# Altium schematic sheet Schematic_1.SchDoc
size A3
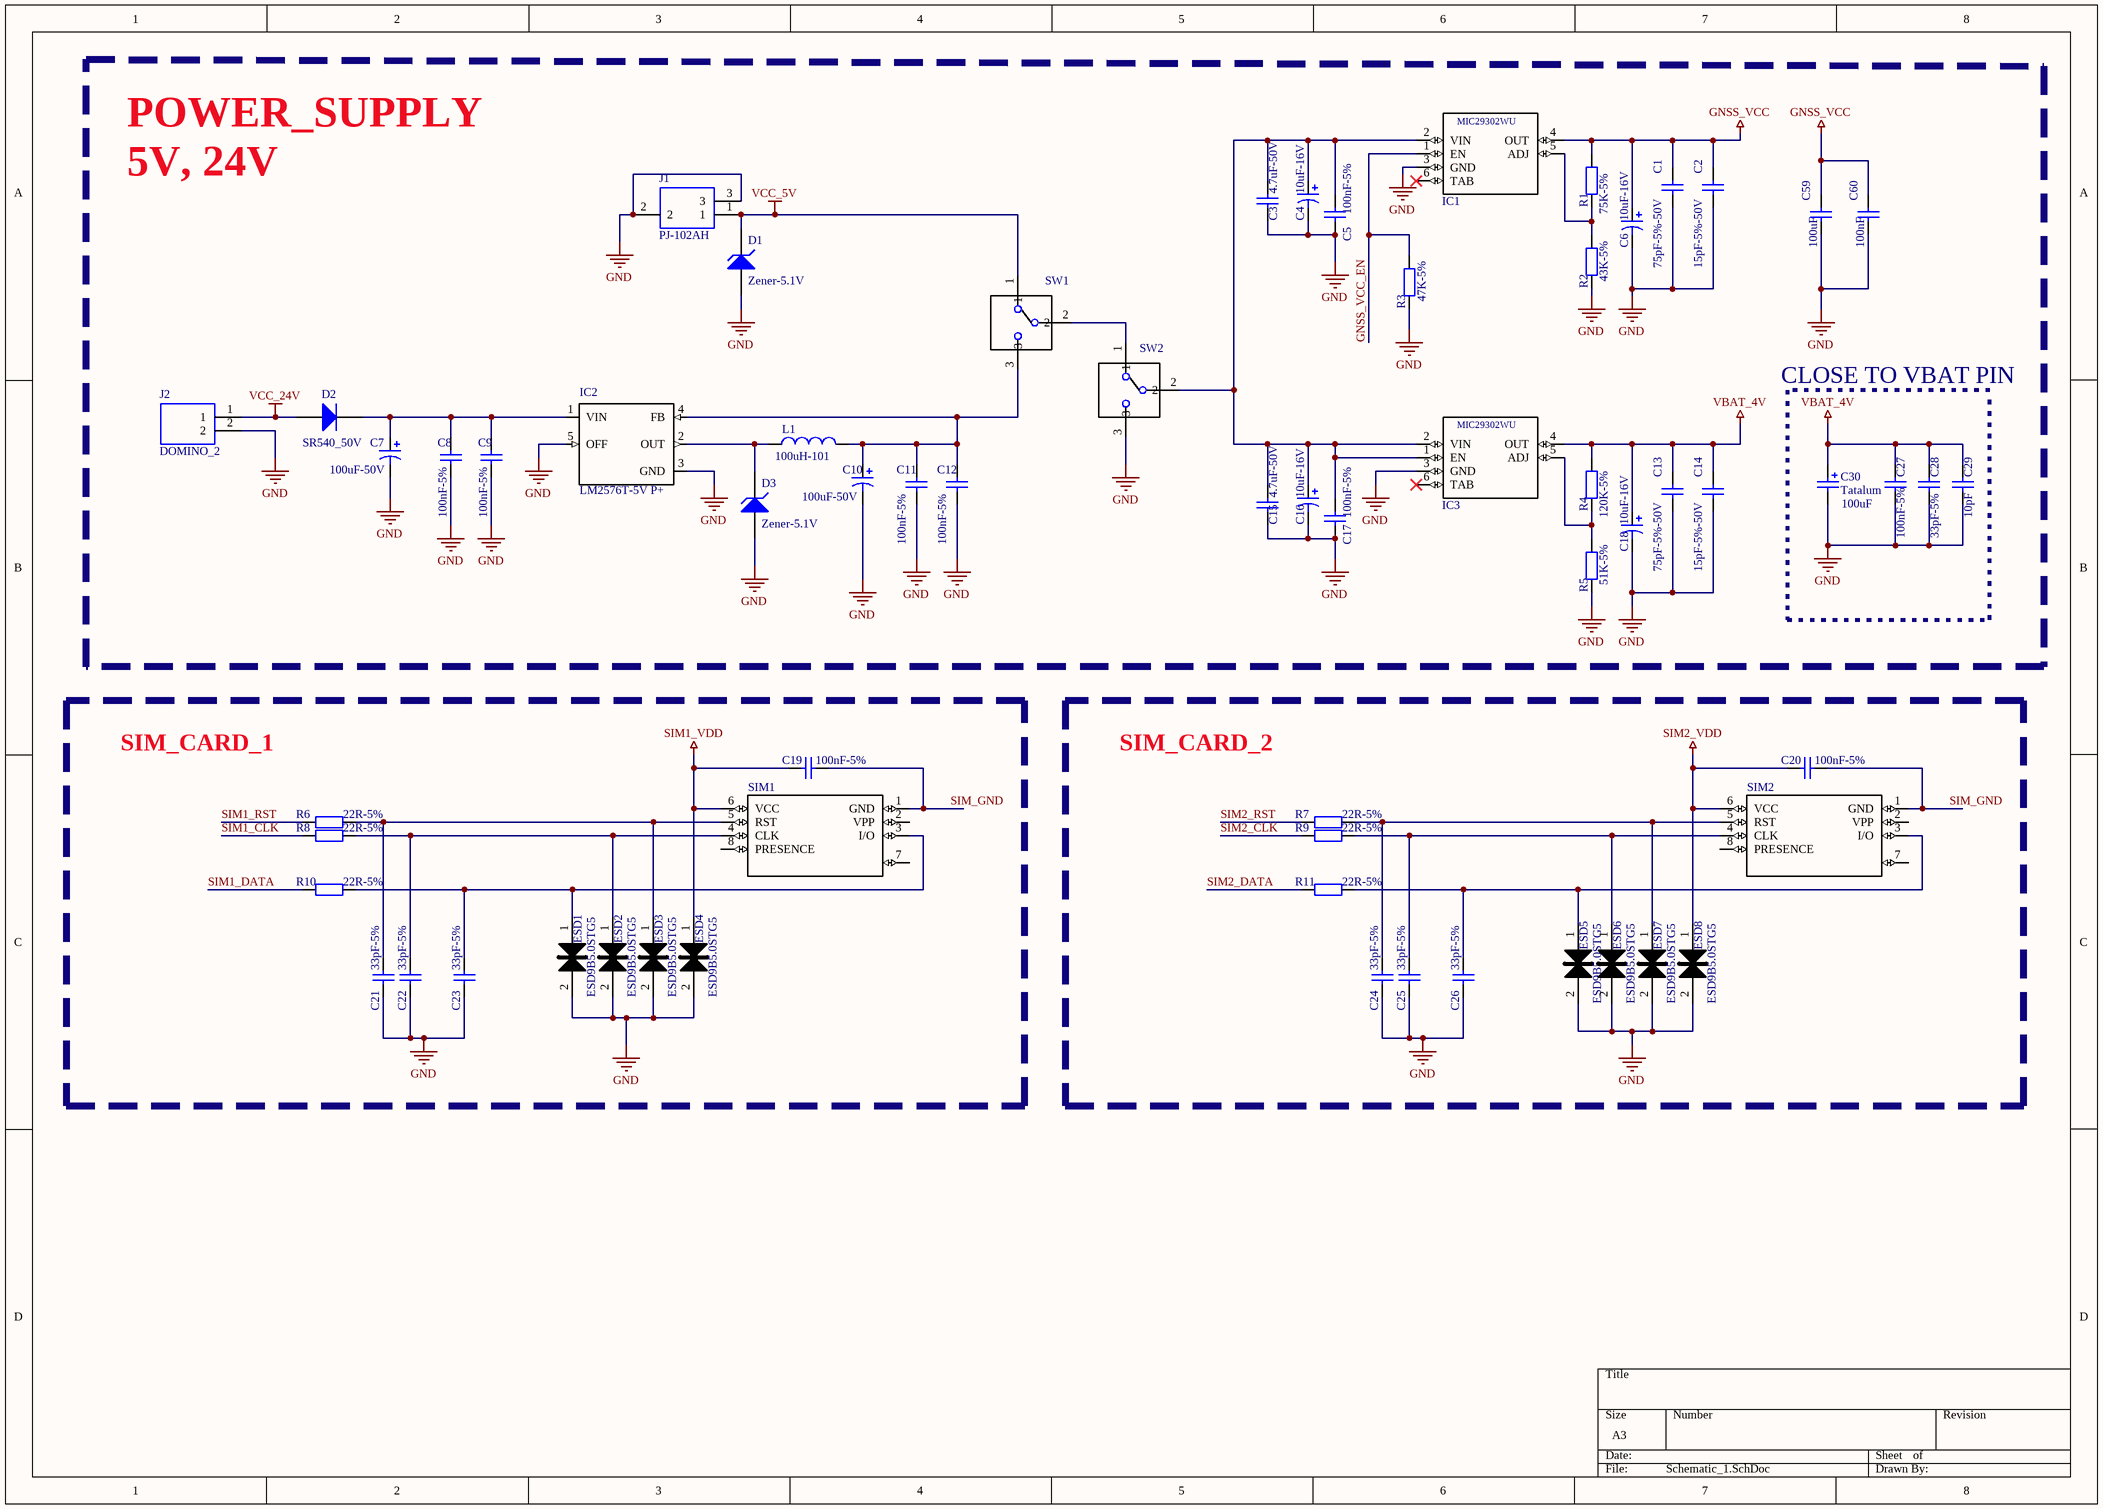
[diagram p0: Schematic_1.SchDoc]

## Parts
C1  value 75pF-5%-50V  [6-0805_L]  (hidden comment: Cap)
C2  value 15pF-5%-50V  [C0805]  (hidden comment: Cap)
C3  value 4.7uF-50V  [C0805]  (hidden comment: Cap)
C4  value 10uF-16V  [c0805]  (hidden comment: Cap Pol1)
C5  value 100nF-5%  [C0805]  (hidden comment: Cap)
C6  value 10uF-16V  [C0805]  (hidden comment: Cap Pol1)
C7  value 100uF-50V  [CAP_ALUM_100uF_8x10]  (hidden comment: Cap Pol3)
C8  value 100nF-5%  [6-0805_L]  (hidden comment: Cap)
C9  value 100nF-5%  [6-0805_L]  (hidden comment: Cap)
C10  value 100uF-50V  [CAP_ALUM_100uF_8x10]  (hidden comment: Cap Pol3)
C11  value 100nF-5%  [6-0805_L]  (hidden comment: Cap)
C12  value 100nF-5%  [6-0805_L]  (hidden comment: Cap)
C13  value 75pF-5%-50V  [6-0805_L]  (hidden comment: Cap)
C14  value 15pF-5%-50V  [C0805]  (hidden comment: Cap)
C15  value 4.7uF-50V  [C0805]  (hidden comment: Cap)
C16  value 10uF-16V  [c0805]  (hidden comment: Cap Pol1)
C17  value 100nF-5%  [C0805]  (hidden comment: Cap)
C18  value 10uF-16V  [C0805]  (hidden comment: Cap Pol1)
C19  value 100nF-5%  [6-0805_L]  (hidden comment: Cap)
C20  value 100nF-5%  [6-0805_L]  (hidden comment: Cap)
C21  value 33pF-5%  [6-0805_L]  (hidden comment: Cap)
C22  value 33pF-5%  [6-0805_L]  (hidden comment: Cap)
C23  value 33pF-5%  [6-0805_L]  (hidden comment: Cap)
C24  value 33pF-5%  [6-0805_L]  (hidden comment: Cap)
C25  value 33pF-5%  [6-0805_L]  (hidden comment: Cap)
C26  value 33pF-5%  [6-0805_L]  (hidden comment: Cap)
C27  value 100nF-5%  [C0805]  (hidden comment: Cap)
C28  value 33pF-5%  [C0805]  (hidden comment: Cap)
C29  value 10pF  [C0805]  (hidden comment: Cap)
C30  Tatalum  value 100uF  [Tantalum_7343]
C59  value 100uF  [6-0805_L]  (hidden comment: Cap)
C60  value 100nF  [6-0805_L]  (hidden comment: Cap)
D1  Zener-5.1V  [Zener_SMD]
D2  SR540_50V  [DIODE_40V_5A]
D3  Zener-5.1V  [Zener_SMD]
ESD1  ESD9B5.0STG5  [ESD9B5.0STG5]
ESD2  ESD9B5.0STG5  [ESD9B5.0STG5]
ESD3  ESD9B5.0STG5  [ESD9B5.0STG5]
ESD4  ESD9B5.0STG5  [ESD9B5.0STG5]
ESD5  ESD9B5.0STG5  [ESD9B5.0STG5]
ESD6  ESD9B5.0STG5  [ESD9B5.0STG5]
ESD7  ESD9B5.0STG5  [ESD9B5.0STG5]
ESD8  ESD9B5.0STG5  [ESD9B5.0STG5]
IC1  MIC29302WU  [MIC29302WU_3D]  (value not drawn)
IC2  LM2576T-5V P+  [MIC29302WU_3D]
IC3  MIC29302WU  [MIC29302WU_3D]  (value not drawn)
J1  PJ-102AH  [DC_Jack]
J2  DOMINO_2  [DOMINO_2]
L1  value 100uH-101  [INDUCTOR_SMD_12x12]  (hidden comment: Inductor)
R1  value 75K-5%  [6-0805_L]  (hidden comment: Res2)
R2  value 43K-5%  [6-0805_L]  (hidden comment: Res2)
R3  47K-5%  [6-0805_L]
R4  value 120K-5%  [6-0805_L]  (hidden comment: Res2)
R5  value 51K-5%  [6-0805_L]  (hidden comment: Res2)
R6  value 22R-5%  [6-0805_L]  (hidden comment: Res2)
R7  value 22R-5%  [6-0805_L]  (hidden comment: Res2)
R8  value 22R-5%  [6-0805_L]  (hidden comment: Res2)
R9  value 22R-5%  [6-0805_L]  (hidden comment: Res2)
R10  value 22R-5%  [6-0805_L]  (hidden comment: Res2)
R11  value 22R-5%  [6-0805_L]  (hidden comment: Res2)
SIM1  912283001  [SIM_CARD]  (value not drawn)
SIM2  912283001  [SIM_CARD]  (value not drawn)
SW1  DIP-SLIDE-SWITCH(3P-11.6X4.0X5.4+2.0MM)  [SLIDE_SWITCH_3PINS]  (value not drawn)
SW2  DIP-SLIDE-SWITCH(3P-11.6X4.0X5.4+2.0MM)  [SLIDE_SWITCH_3PINS]  (value not drawn)

## Blocks framed on the sheet
CLOSE TO VBAT PIN: C1-C18 C27-C30 C59 C60 D1-D3 IC1-IC3 J1 J2 L1 R1-R5 SW1 SW2

## Nets
GND: C1.1 C2.1 C3.1 C4.2 C5.1 C6.2 C7.2 C8.1 C9.1 C10.2 C11.1 C12.1 C13.1 C14.1 C15.1 C16.2 C17.1 C18.2 C21.1 C22.1 C23.1 C24.1 C25.1 C26.1 C27.1 C28.2 C29.1 C30.2 C59.1 C60.1 D1.1(A) D3.1(A) ESD1.2(K) ESD2.2(K) ESD3.2(K) ESD4.2(K) ESD5.2(K) ESD6.2(K) ESD7.2(K) ESD8.2(K) IC1.3(GND) IC2.3(GND) IC2.5(OFF) IC3.3(GND) J1.2 J1.3 J2.2 R2.1 R3.1 R5.1 SW2.3
GNSS_VCC: C1.2 C2.2 C6.1 C59.2 C60.2 IC1.4(OUT) R1.2
SIM1_VDD: C19.1 ESD4.1(A) SIM1.6(VCC)
SIM2_VDD: C20.1 ESD8.1(A) SIM2.6(VCC)
VBAT_4V: C13.2 C14.2 C18.1 C27.2 C28.1 C29.2 C30.1 IC3.4(OUT) R4.2
VCC_5V: D1.2(K) J1.1 SW1.1
VCC_24V: D2.1(A) J2.1
GNSS_VCC_EN: IC1.1(EN) R3.2
SIM1_CLK: R8.2
SIM1_DATA: R10.2
SIM1_RST: R6.2
SIM2_CLK: R9.2
SIM2_DATA: R11.2
SIM2_RST: R7.2
SIM_GND: C19.2 C20.2 SIM1.1(GND) SIM2.1(GND)
NetC3_2: C3.2 C4.1 C5.2 C15.2 C16.1 C17.2 IC1.2(VIN) IC3.1(EN) IC3.2(VIN) SW2.2
NetC7_1: C7.1 C8.2 C9.2 D2.2(K) IC2.1(VIN)
NetC10_1: C10.1 C11.2 C12.2 IC2.4(FB) L1.2 SW1.3
NetC21_2: C21.2 ESD3.1(A) R6.1 SIM1.5(RST)
NetC22_2: C22.2 ESD2.1(A) R8.1 SIM1.4(CLK)
NetC23_2: C23.2 ESD1.1(A) R10.1 SIM1.3(I/O)
NetC24_2: C24.2 ESD7.1(A) R7.1 SIM2.5(RST)
NetC25_2: C25.2 ESD6.1(A) R9.1 SIM2.4(CLK)
NetC26_2: C26.2 ESD5.1(A) R11.1 SIM2.3(I/O)
NetD3_2: D3.2(K) IC2.2(OUT) L1.1
NetIC1_5: IC1.5(ADJ) R1.1 R2.2
NetIC3_5: IC3.5(ADJ) R4.1 R5.2
NetSW1_2: SW1.2 SW2.1

Not connected (* = marked no-connect by the designer): IC1 6(TAB)*; IC3 6(TAB)*; SIM1 2(VPP) 7 8(PRESENCE); SIM2 2(VPP) 7 8(PRESENCE)

## Notes on the sheet
- POWER_SUPPLY
  5V, 24V
- SIM_CARD_1
- SIM_CARD_2

## Library data of the parts
C1-C3 C5 C8 C9 C11-C15 C17 C19-C29 C59 C60 = Cap: Capacitor; Published: 8-Jun-2000; LatestRevisionDate: 17-Jul-2002; LatestRevisionNote: Re-released for DXP Platform.; PackageReference: RAD-0.3; Publisher: Altium Limited; PackageDescription: Radial Cap, Thru-Hole; 2 Leads; 0.3 in Pin Spacing
C4 C6 C16 C18 = Cap Pol1: Polarized Capacitor (Radial); Published: 8-Jun-2000; LatestRevisionDate: 17-Jul-2002; LatestRevisionNote: Re-released for DXP Platform.; PackageReference: RB7.6-15; Publisher: Altium Limited; PackageDescription: Polarized Capacitor (Radial); 2 Leads
C7 C10 = Cap Pol3: Polarized Capacitor (Surface Mount); Published: 8-Jun-2000; LatestRevisionDate: 29-May-2009; LatestRevisionNote: IPC-7351 Footprint Added.; PackageReference: C0805; Publisher: Altium Limited; PackageDescription: Chip Capacitor
C30 = Cap Pol2: Polarized Capacitor (Axial); Published: 8-Jun-2000; LatestRevisionDate: 17-Jul-2002; LatestRevisionNote: Re-released for DXP Platform.; PackageReference: POLAR0.8; Publisher: Altium Limited; PackageDescription: Polarized Capacitor; 2 Leads
D1 D3 = D Zener: Zener Diode; Published: 8-Jun-2000; LatestRevisionDate: 17-Jul-2002; LatestRevisionNote: Re-released for DXP Platform.; PackageReference: DIODE-0.7; Publisher: Altium Limited; PackageDescription: Diode, Thru-Hole; 2 Leads; 0.7 in Pin Spacing
D2 = Diode: Default Diode; Published: 8-Jun-2000; LatestRevisionDate: 17-Jul-2002; LatestRevisionNote: Re-released for DXP Platform.; PackageVersion: Sep-1996; PackageReference: SMC; Publisher: Altium Limited; PackageDescription: DO-214-AB/SMC; 2 C-Bend Leads; Body 7.9 x 5.9 mm, inc. leads (LxW); Code_JEDEC: DO-214-AB
ESD1-ESD8 = 1
IC1 IC3 = MIC29302WU: MIC29302 Series 3 A 1.24 to 26 V ADJ Output Voltage LDO Regulator - TO-263-5; MF: Microchip; Package: TO-263-5 Microchip; Availability: Good; SnapEDA_Link: https://www.snapeda.com/symbols-footprints/MIC29302WU/Microchip/view-part/?ref=snap; Price: 1.37 USD; MP: MIC29302WU; Value: *
IC2 = LM2576: Integrated Circuit; MF: National Semiconductor; Package: TO-263-6 National Semiconductor; Availability: Unavailable; SnapEDA_Link: https://www.snapeda.com/parts/LM2576/National%20Semiconductor/view-part/?ref=snap; Price: None; MP: LM2576; Value: *
J1 = PJ-102AH: DC POWER JACK; Manufacturer_Name: CUI; Manufacturer_Part_Number: PJ-102AH; RS Part Number: *; RS Price/Stock: *; Datasheet Link: http://www.cui.com/product/resource/digikeypdf/pj-102ah.pdf
J2 = 1715721: 2 way std vertical terminal,5.08mm pitch; Manufacturer_Name: Phoenix Contact; Allied_Number: 70054416; Geometry.Height: 13.8mm; Manufacturer_Part_Number: 1715721; RS Part Number: 1930564; RS Price/Stock: http://uk.rs-online.com/web/p/products/1930564; Allied Price/Stock: http://www.alliedelec.com/phoenix-contact-1715721/70054416/; Arrow Part Number: 1715721; Arrow Price/Stock: https://www.arrow.com/en/products/1715721/phoenix-contact; Datasheet Link: http://docs-europe.electrocomponents.com/webdocs/1380/0900766b81380185.pdf
L1 = Inductor: Code_IEC: 1005; Published: 8-Jun-2000; LatestRevisionDate: 29-May-2009; LatestRevisionNote: IPC-7351 Footprint Added.; PackageReference: 0402-A; Publisher: Altium Limited; PackageDescription: Chip Inductor; Code_JEITA: 0402
R1-R11 = Res2: Resistor; Published: 8-Jun-2000; LatestRevisionDate: 17-Jul-2002; LatestRevisionNote: Re-released for DXP Platform.; PackageReference: AXIAL-0.4; Publisher: Altium Limited; PackageDescription: Axial Device, Thru-Hole; 2 Leads; 0.4 in Pin Spacing
SIM1 SIM2 = 912283001: 2.54mm Pitch ChipSIM Connector with Ejector, 6 Circuits, without Pegs, Yellow Button; MP: 91228-3001; MF: Molex; SnapEDA_Link: https://www.snapeda.com/symbols-footprints/91228-3001/Molex/view-part/?ref=snap; Package: None; Price: 2.82 USD; Availability: Good; Value: *
SW1 SW2 = DIP-SLIDE-SWITCH(3P-11.6X4.0X5.4+2.0MM): EG Series SPDT On-On Vertical Through Hole Slide Switch; MP: EG1218; Availability: Good; MF: E-Switch; Package: FakePackage u; Price: 0.41 USD; SnapEDA_Link: https://www.snapeda.com/symbols-footprints/EG1218/E-Switch/view-part/?ref=snap; Value: *